# EAGLE design primus (EAGLE 6.1)
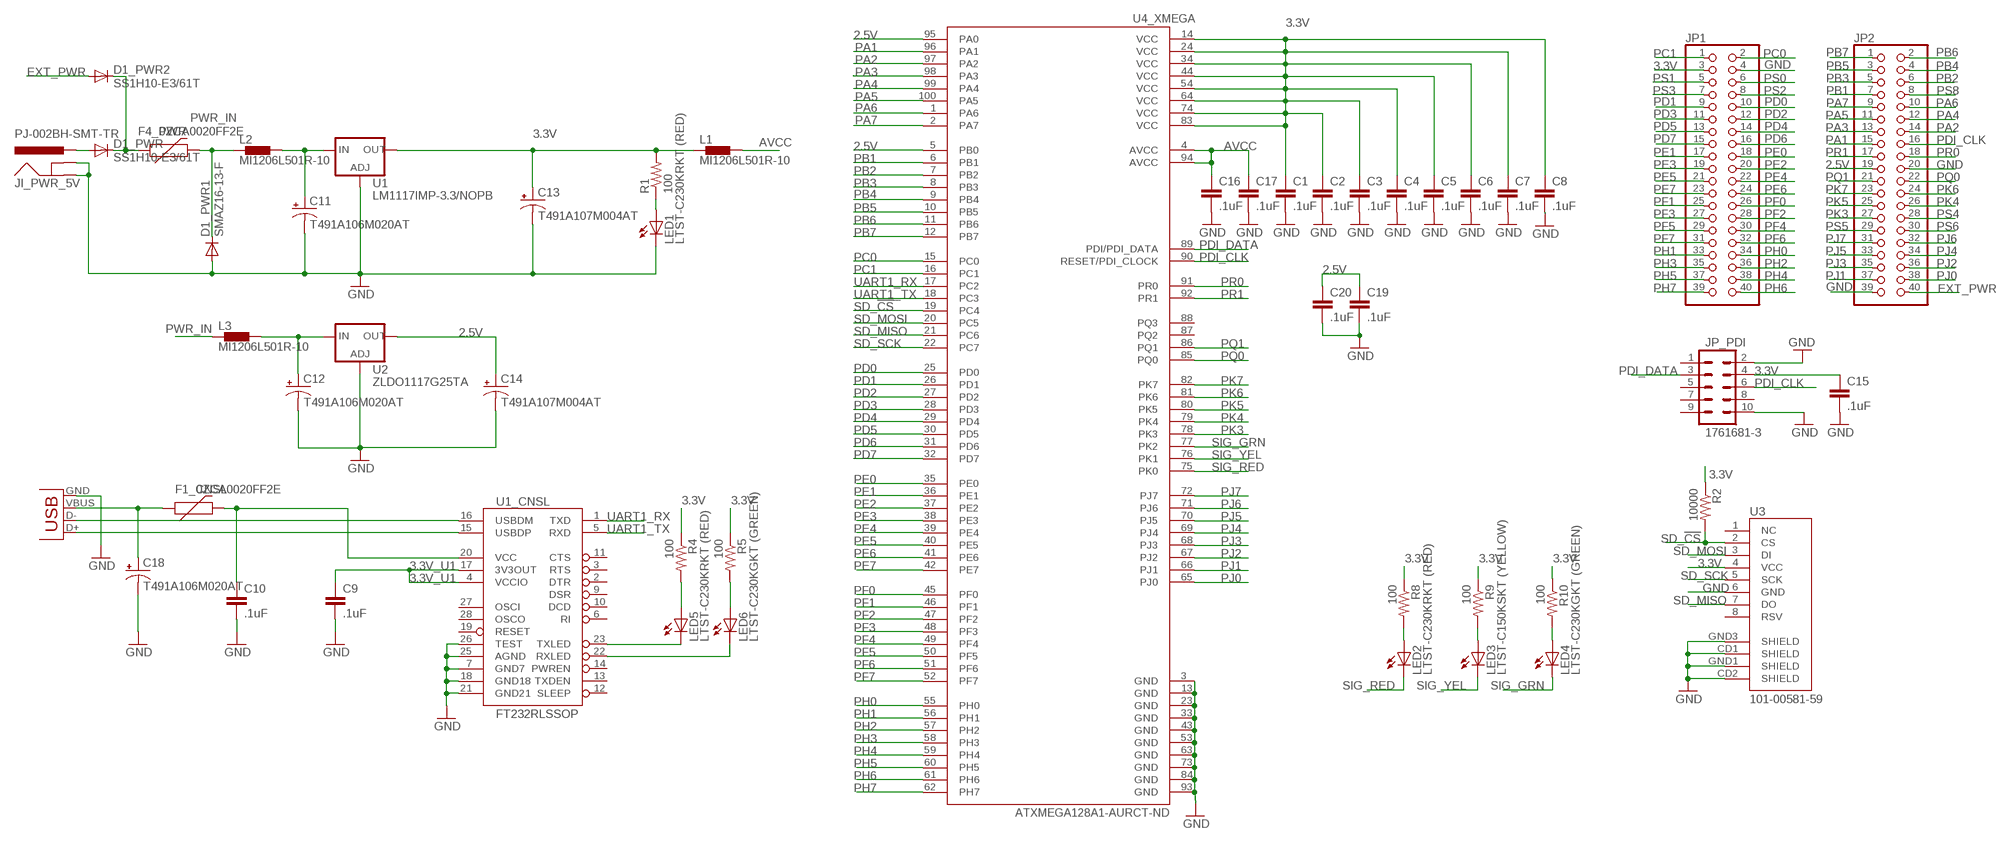
[diagram p0: schematic, sheet 1]

## Parts
C1  .1uF  CAP0603-CAP  [0603-CAP]
C2  .1uF  CAP0603-CAP  [0603-CAP]
C3  .1uF  CAP0603-CAP  [0603-CAP]
C4  .1uF  CAP0603-CAP  [0603-CAP]
C5  .1uF  CAP0603-CAP  [0603-CAP]
C6  .1uF  CAP0603-CAP  [0603-CAP]
C7  .1uF  CAP0603-CAP  [0603-CAP]
C8  .1uF  CAP0603-CAP  [0603-CAP]
C9  .1uF  CAP0603-CAP  [0603-CAP]
C10  .1uF  CAP0603-CAP  [0603-CAP]
C11  T491A106M020AT  CAP_POL1206  [EIA3216]
C12  T491A106M020AT  CAP_POL1206  [EIA3216]
C13  T491A107M004AT  CAP_POL1206  [EIA3216]
C14  T491A107M004AT  CAP_POL1206  [EIA3216]
C15  .1uF  CAP0603-CAP  [0603-CAP]
C16  .1uF  CAP0603-CAP  [0603-CAP]
C17  .1uF  CAP0603-CAP  [0603-CAP]
C18  T491A106M020AT  CAP_POL1206  [EIA3216]
C19  .1uF  CAP0603-CAP  [0603-CAP]
C20  .1uF  CAP0603-CAP  [0603-CAP]
D1_PWR  SS1H10-E3/61T  DIODESMA  [SMA-DIODE]
D1_PWR1  SMAZ16-13-F  DIODESMA  [SMA-DIODE]
D1_PWR2  SS1H10-E3/61T  DIODESMA  [SMA-DIODE]
F1_CNSL  0ZCA0020FF2E  PTCSMD  [PTC-1206]
F4_PWR  0ZCA0020FF2E  PTCSMD  [PTC-1206]
JI_PWR_5V  PJ-002BH-SMT-TR  POWER_JACKSMD  [POWER_JACK_SMD]
JP1  PINHD-2X20  [2X20]
JP2  PINHD-2X20  [2X20]
JP_PDI  1761681-3  M05X2SHD  [2X5-SHROUDED]
L1  MI1206L501R-10  [1206]
L2  MI1206L501R-10  [1206]
L3  MI1206L501R-10  [1206]
LED1  LTST-C230KRKT (RED)  LED1206  [LED-1206]
LED2  LTST-C230KRKT (RED)  LED1206  [LED-1206]
LED3  LTST-C150KSKT (YELLOW)  LED1206  [LED-1206]
LED4  LTST-C230KGKT (GREEN)  LED1206  [LED-1206]
LED5  LTST-C230KRKT (RED)  LED1206  [LED-1206]
LED6  LTST-C230KGKT (GREEN)  LED1206  [LED-1206]
R1  100  RESISTOR0603-RES  [0603-RES]
R2  10000  RESISTOR0603-RES  [0603-RES]
R4  100  RESISTOR0603-RES  [0603-RES]
R5  100  RESISTOR0603-RES  [0603-RES]
R8  100  RESISTOR0603-RES  [0603-RES]
R9  100  RESISTOR0603-RES  [0603-RES]
R10  100  RESISTOR0603-RES  [0603-RES]
U1  LM1117IMP-3.3/NOPB  V_REG_317SMD  [SOT223]
U1_CNSL  FT232RLSSOP  [SSOP28DB]
U2  ZLDO1117G25TA  V_REG_317SMD  [SOT223]
U3  101-00581-59  USD-SOCKETNEW  [MICRO-SD-SOCKET-PP]
U4_XMEGA  ATXMEGA128A1-AURCT-ND  XMEGA-100SMD  [TQFP-100-14X14MM]
X2_CNSL  UX60A-MB-5ST  USBSMD  [USB-MINIB]

## Nets
2.5V: C14.A(+) C19.1 C20.1 JP2.19 U2.2(OUT) U4_XMEGA.5(PB0) U4_XMEGA.95(PA0)
3.3V [power]: C1.1 C2.1 C3.1 C4.1 C5.1 C6.1 C7.1 C8.1 C13.A(+) C15.1 JP1.3 JP_PDI.4 L1.1 R1.2 R2.1 R4.1 R5.1 R8.1 R9.1 R10.1 U1.2(OUT) U3.4(VCC) U4_XMEGA.14(VCC) U4_XMEGA.24(VCC) U4_XMEGA.34(VCC) U4_XMEGA.44(VCC) U4_XMEGA.54(VCC) U4_XMEGA.64(VCC) U4_XMEGA.74(VCC) U4_XMEGA.83(VCC)
3.3V_U1 [power]: C9.1 U1_CNSL.4(VCCIO) U1_CNSL.17(3V3OUT)
AVCC: C16.1 C17.1 L1.2 U4_XMEGA.4(AVCC) U4_XMEGA.94(AVCC)
EXT_PWR: D1_PWR2.A JP2.40
GND [power]: C1.2 C2.2 C3.2 C4.2 C5.2 C6.2 C7.2 C8.2 C9.2 C10.2 C11.C(-) C12.C(-) C13.C(-) C14.C(-) C15.2 C16.2 C17.2 C18.C(-) C19.2 C20.2 D1_PWR1.A JI_PWR_5V.GND(GNDBREAK) JI_PWR_5V.P$4(GND) JP1.4 JP2.20 JP2.39 JP_PDI.2 JP_PDI.10 LED1.C U1.1(ADJ) U1_CNSL.7(GND7) U1_CNSL.18(GND18) U1_CNSL.21(GND21) U1_CNSL.25(AGND) U1_CNSL.26(TEST) U2.1(ADJ) U3.6(GND) U3.CD1(SHIELD) U3.CD2(SHIELD) U3.GND1(SHIELD) U3.GND3(SHIELD) U4_XMEGA.3(GND) U4_XMEGA.13(GND) U4_XMEGA.23(GND) U4_XMEGA.33(GND) U4_XMEGA.43(GND) U4_XMEGA.53(GND) U4_XMEGA.63(GND) U4_XMEGA.73(GND) U4_XMEGA.84(GND) U4_XMEGA.93(GND) X2_CNSL.GND
N$1: LED5.A R4.2
N$2: LED6.A R5.2
N$4: LED2.A R8.2
N$5: LED3.A R9.2
N$6: LED4.A R10.2
N$7: C11.A(+) L2.2 U1.3(IN)
N$8: C12.A(+) L3.2 U2.3(IN)
N$15: D1_PWR.A JI_PWR_5V.VIN0(PWR)
N$16: D1_PWR2.C D1_PWR.C F4_PWR.1
N$19: LED1.A R1.1
N$20 [power]: C10.1 F1_CNSL.2 U1_CNSL.20(VCC)
PA1: JP2.15 U4_XMEGA.96(PA1)
PA2: JP2.14 U4_XMEGA.97(PA2)
PA3: JP2.13 U4_XMEGA.98(PA3)
PA4: JP2.12 U4_XMEGA.99(PA4)
PA5: JP2.11 U4_XMEGA.100(PA5)
PA6: JP2.10 U4_XMEGA.1(PA6)
PA7: JP2.9 U4_XMEGA.2(PA7)
PB1: JP2.7 U4_XMEGA.6(PB1)
PB2: JP2.6 U4_XMEGA.7(PB2)
PB3: JP2.5 U4_XMEGA.8(PB3)
PB4: JP2.4 U4_XMEGA.9(PB4)
PB5: JP2.3 U4_XMEGA.10(PB5)
PB6: JP2.2 U4_XMEGA.11(PB6)
PB7: JP2.1 U4_XMEGA.12(PB7)
PC0: JP1.2 U4_XMEGA.15(PC0)
PC1: JP1.1 U4_XMEGA.16(PC1)
PD0: JP1.10 U4_XMEGA.25(PD0)
PD1: JP1.9 U4_XMEGA.26(PD1)
PD2: JP1.12 U4_XMEGA.27(PD2)
PD3: JP1.11 U4_XMEGA.28(PD3)
PD4: JP1.14 U4_XMEGA.29(PD4)
PD5: JP1.13 U4_XMEGA.30(PD5)
PD6: JP1.16 U4_XMEGA.31(PD6)
PD7: JP1.15 U4_XMEGA.32(PD7)
PDI_CLK: JP2.16 JP_PDI.6 U4_XMEGA.90(RESET/PDI_CLOCK)
PDI_DATA: JP_PDI.3 U4_XMEGA.89(PDI/PDI_DATA)
PE0: JP1.18 U4_XMEGA.35(PE0)
PE1: JP1.17 U4_XMEGA.36(PE1)
PE2: JP1.20 U4_XMEGA.37(PE2)
PE3: JP1.19 U4_XMEGA.38(PE3)
PE4: JP1.22 U4_XMEGA.39(PE4)
PE5: JP1.21 U4_XMEGA.40(PE5)
PE6: JP1.24 U4_XMEGA.41(PE6)
PE7: JP1.23 U4_XMEGA.42(PE7)
PF0: JP1.26 U4_XMEGA.45(PF0)
PF1: JP1.25 U4_XMEGA.46(PF1)
PF2: JP1.28 U4_XMEGA.47(PF2)
PF3: JP1.27 U4_XMEGA.48(PF3)
PF4: JP1.30 U4_XMEGA.49(PF4)
PF5: JP1.29 U4_XMEGA.50(PF5)
PF6: JP1.32 U4_XMEGA.51(PF6)
PF7: JP1.31 U4_XMEGA.52(PF7)
PH0: JP1.34 U4_XMEGA.55(PH0)
PH1: JP1.33 U4_XMEGA.56(PH1)
PH2: JP1.36 U4_XMEGA.57(PH2)
PH3: JP1.35 U4_XMEGA.58(PH3)
PH4: JP1.38 U4_XMEGA.59(PH4)
PH5: JP1.37 U4_XMEGA.60(PH5)
PH6: JP1.40 U4_XMEGA.61(PH6)
PH7: JP1.39 U4_XMEGA.62(PH7)
PJ0: JP2.38 U4_XMEGA.65(PJ0)
PJ1: JP2.37 U4_XMEGA.66(PJ1)
PJ2: JP2.36 U4_XMEGA.67(PJ2)
PJ3: JP2.35 U4_XMEGA.68(PJ3)
PJ4: JP2.34 U4_XMEGA.69(PJ4)
PJ5: JP2.33 U4_XMEGA.70(PJ5)
PJ6: JP2.32 U4_XMEGA.71(PJ6)
PJ7: JP2.31 U4_XMEGA.72(PJ7)
PK3: JP2.27 U4_XMEGA.78(PK3)
PK4: JP2.26 U4_XMEGA.79(PK4)
PK5: JP2.25 U4_XMEGA.80(PK5)
PK6: JP2.24 U4_XMEGA.81(PK6)
PK7: JP2.23 U4_XMEGA.82(PK7)
PQ0: JP2.22 U4_XMEGA.85(PQ0)
PQ1: JP2.21 U4_XMEGA.86(PQ1)
PR0: JP2.18 U4_XMEGA.91(PR0)
PR1: JP2.17 U4_XMEGA.92(PR1)
PS0: JP1.6
PS1: JP1.5
PS2: JP1.8
PS3: JP1.7
PS4: JP2.28
PS5: JP2.29
PS6: JP2.30
PS8: JP2.8
PWR_IN: D1_PWR1.C F4_PWR.2 L2.1 L3.1
RXLED_U1: LED6.C U1_CNSL.22(RXLED)
SD_!CS: R2.2 U3.2(CS) U4_XMEGA.19(PC4)
SD_MISO: U3.7(DO) U4_XMEGA.21(PC6)
SD_MOSI: U3.3(DI) U4_XMEGA.20(PC5)
SD_SCK: U3.5(SCK) U4_XMEGA.22(PC7)
SIG_GRN: LED4.C U4_XMEGA.77(PK2)
SIG_RED: LED2.C U4_XMEGA.75(PK0)
SIG_YEL: LED3.C U4_XMEGA.76(PK1)
TXLED_U1: LED5.C U1_CNSL.23(TXLED)
UART1_RX: U1_CNSL.1(TXD) U4_XMEGA.17(PC2)
UART1_TX: U1_CNSL.5(RXD) U4_XMEGA.18(PC3)
USB_D+: U1_CNSL.15(USBDP) X2_CNSL.D+
USB_D-: U1_CNSL.16(USBDM) X2_CNSL.D-
VBUS: C18.A(+) F1_CNSL.1 X2_CNSL.VBUS
Unconnected: JP_PDI.1 JP_PDI.5 JP_PDI.7 JP_PDI.8 JP_PDI.9 U1_CNSL.2(DTR) U1_CNSL.3(RTS) U1_CNSL.6(RI) U1_CNSL.9(DSR) U1_CNSL.10(DCD) U1_CNSL.11(CTS) U1_CNSL.12(SLEEP) U1_CNSL.13(TXDEN) U1_CNSL.14(PWREN) U1_CNSL.19(RESET) U1_CNSL.27(OSCI) U1_CNSL.28(OSCO) U3.1(NC) U3.8(RSV) U4_XMEGA.87(PQ2) U4_XMEGA.88(PQ3)

## Library data of the parts
C1-C10 C15-C17 C19 C20 = SparkFun-Passives:CAP: Capacitor Standard 0603 ceramic capacitor, and 0.1" leaded capacitor.
C11-C14 C18 = SparkFun-Passives:CAP_POL: Capacitor Polarized These are standard SMD and PTH capacitors. Normally 10uF, 47uF, and 100uF in electrolytic and tantalum varieties. Always verify the external diameter of the through hole cap, it varies with capacity, voltage, and manufacturer. The EIA devices should be standard.
D1_PWR D1_PWR1 D1_PWR2 = SparkFun-DiscreteSemi:DIODE: Diode These are standard reverse protection diodes and small signal diodes. SMA package can handle up to about 1A. SOD-323 can handle about 200mA. What the SOD-323 package when ordering, there are some mfgs out there that are 5-pin packages.
F1_CNSL F4_PWR = SparkFun:PTC: Resettable Fuse PTC Resettable Fuse. Spark Fun Electronics SKU : COM-08357
JI_PWR_5V = SparkFun-Connectors:POWER_JACK: Power Jack This is the standard 5.5mm barrel jack for power. The PTH is the most common, proven, reliable, footprint. All others are experimental. The Slot footprint only works if the mill layer is transmitted to the PCB fab house so be warned. Spark Fun Electronics SKU : PRT-00119. Mating wall wart : TOL-00298 (and others)
JP1 JP2 = pinhead:PINHD-2X20: PIN HEADER
JP_PDI = SparkFun-Connectors:M05X2: Header 5x2 Standard 10-pin dual row 0.1" header. Commonly used with AVR-ISP. Use with Spark Fun Electronics SKU: PRT-00778
L1-L3 = myLib:MI1206L501R-10: FERRITE CHIP POWER 500 OHM SMD
LED1-LED6 = SparkFun-LED:LED: LEDs Standard schematic elements and footprints for 5mm, 3mm, 1206, and 0603 sized LEDs. 5mm - Spark Fun Electronics SKU : COM-00529 (and others)
R1 R2 R4 R5 R8-R10 = SparkFun-Passives:RESISTOR: Resistor Basic schematic elements and footprints for 0603, 1206, and PTH resistors.
U1 U2 = SparkFun-PowerIC:V_REG_317: Voltage Regulator Standard LM317 adjustable voltage regulator. AOI (Adjust Output Input). Google 'LM317 Calculator' for easy to use app to get the two resistor values needed. 240/720 for 5V output. 240/390 for 3.3V output. Spark Fun Electronics SKU : COM-00527
U1_CNSL = SparkFun:FT232RL: USB UART FT232RL 4th Generation USB UART (USB <-> Serial) Controller. Spark Fun Electronics SKU : COM-00650
U3 = SparkFun-Connectors:USD-SOCKET: microSD Socket Push-push type uSD socket. Schematic element and footprint production proven. Spark Fun Electronics SKU : PRT-00127. tDoc lines correctly indicate media card edge positions when inserting (unlocked, locked, depressed).
U4_XMEGA = SparkFun-DigitalIC:XMEGA-100: Atmel XMega uC
X2_CNSL = SparkFun:USB: USB Connectors USB-B-PTH is fully proven SKU : PRT-00139 USB-miniB is fully proven SKU : PRT-00587 USB-A-PCB is untested. USB-A-H is throughly reviewed, but untested. Spark Fun Electronics SKU : PRT-00437 USB-B-SMT is throughly reviewed, but untested. Needs silkscreen touching up. USB-A-S has not been used/tested USB-MB-H has not been used/tested

## Net classes
0 default: width 0.203 mm
1 power: width 0.254 mm

## Board
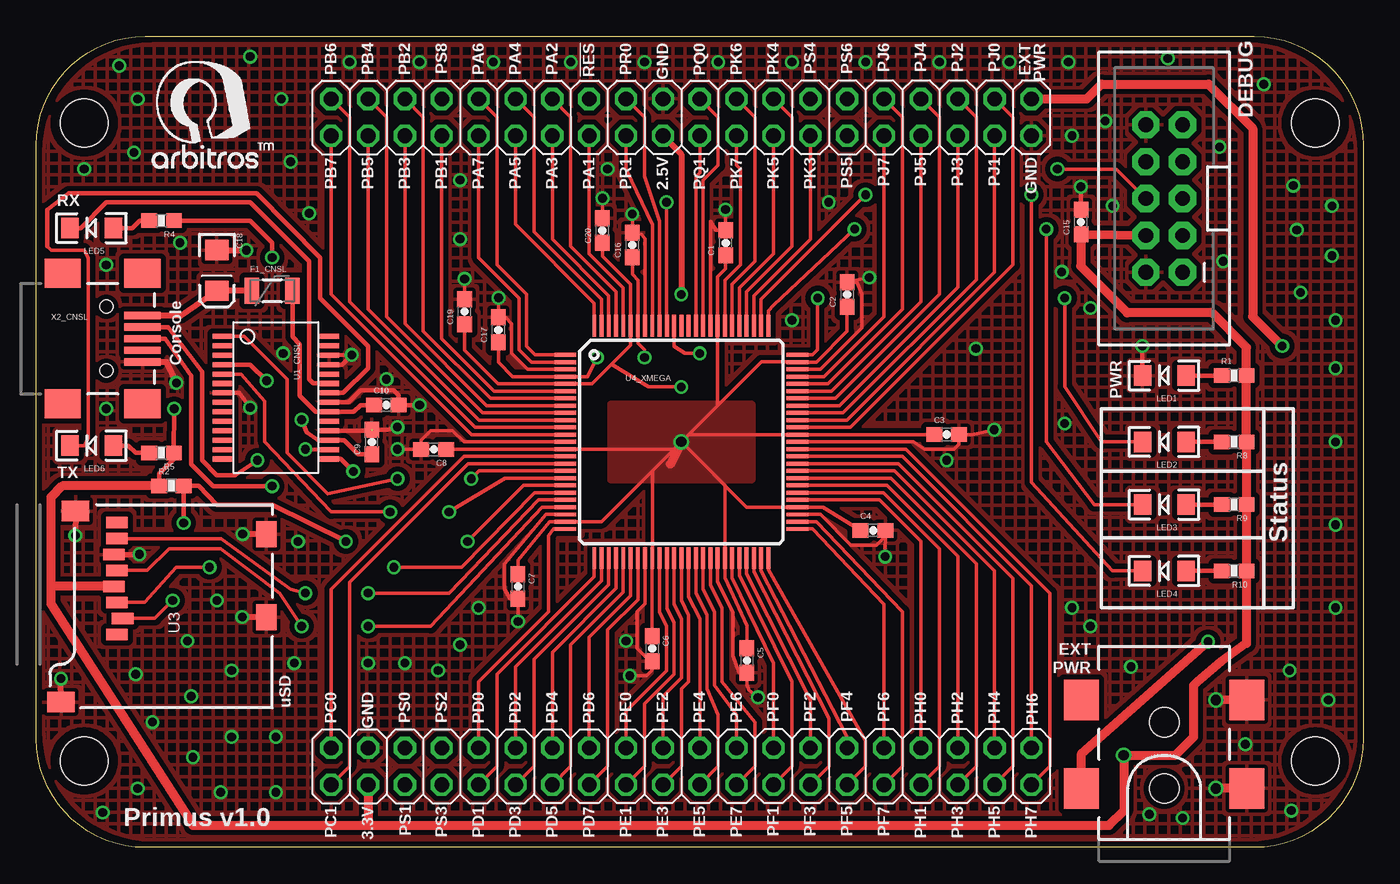
[diagram p1: board, top side]
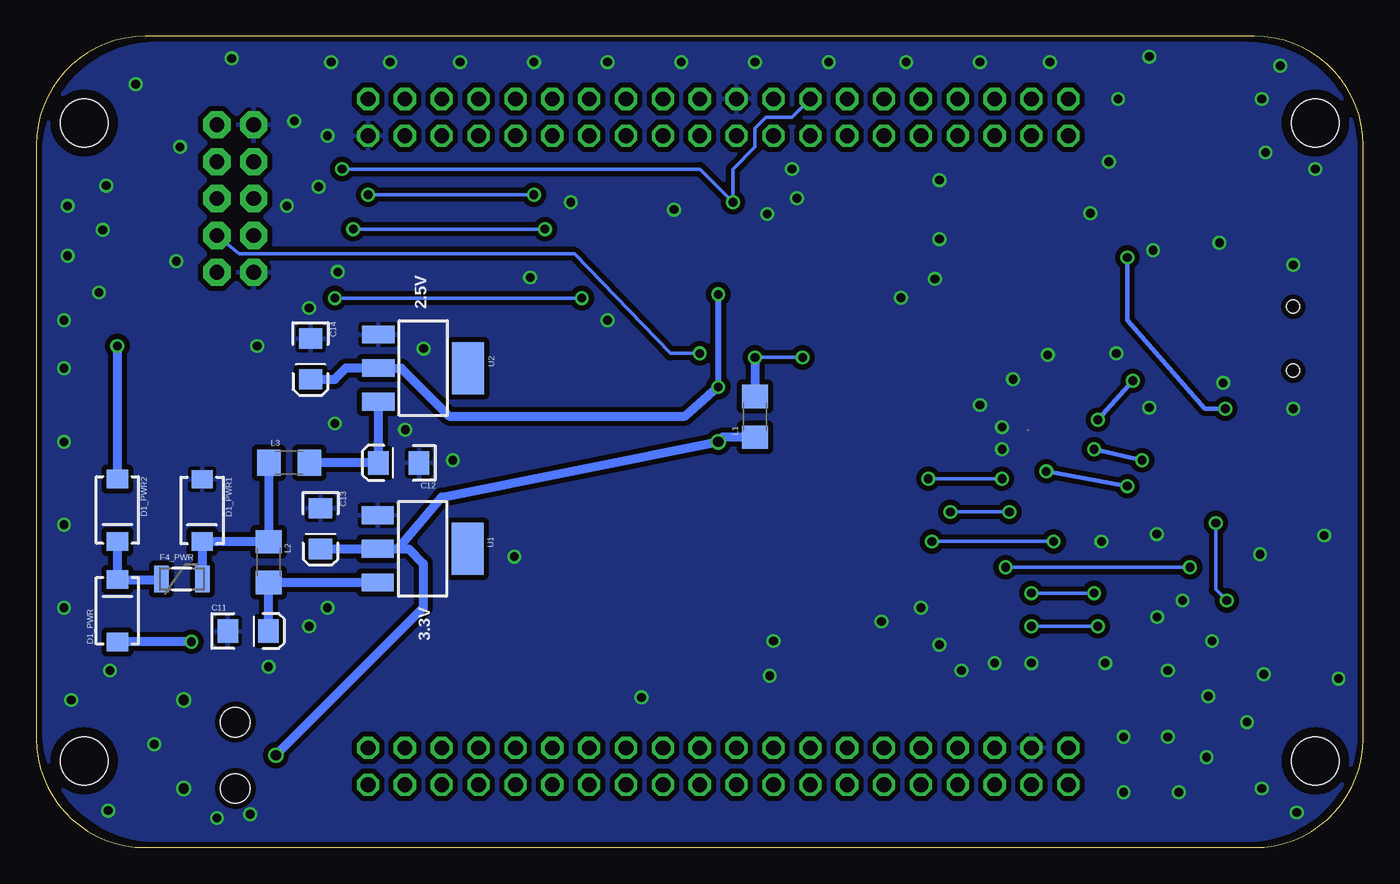
[diagram p2: board, bottom side, seen from below]

Size 91.44 x 55.88 mm. Coordinates in mm from the lower left corner, seen from the top.
Outline: 7.5,55.88 83.94,55.88 arc-90 91.44,48.38 91.44,7.5 arc-90 83.94,0 7.5,0 arc-90 0,7.5 0,48.38 arc-90 7.5,55.88
Copper layers (1*16): Top 0.0356mm / dielectric 1.5011mm / Bottom 0.0356mm
Design rules: minimum track width 6mil, minimum drill 13mil, track to track 6mil, track to pad 6mil, pad to pad 6mil, via to via 6mil, smd to smd 6mil, copper to edge 15mil, drill to drill 6mil, minimum pad ring 7mil, minimum via ring 7mil, stop-mask expansion 4mil, vias tented up to drill 0mil, thermal gap 10mil

### Footprints (pad centres in the part's own frame; a part is rotated, then mirrored left to right if it is on the bottom)
0603-CAP = smd 1.1 x 1: 1 -0.85,0; 2 0.85,0
EIA3216 = smd 1.4 x 1.6: A 1.4,0; C -1.4,0
SMA-DIODE = smd 1.27 x 1.47: A -2.15,0; C 2.15,0
PTC-1206 = smd 1 x 1.8: 1 -1.4,0; 2 1.4,0
POWER_JACK_SMD = smd 2.8 x 2.4: GND 0,-5.7; P$4 6.1,-5.7; VIN0 0,5.7; VIN1 6.1,5.7 | hole 2.032: 0,0; 4.572,0
2X20 = drill 1.016 octagon: 1 -24.13,-1.27; 2 -24.13,1.27; 3 -21.59,-1.27; 4 -21.59,1.27; 5 -19.05,-1.27; 6 -19.05,1.27; 7 -16.51,-1.27; 8 -16.51,1.27; 9 -13.97,-1.27; 10 -13.97,1.27; 11 -11.43,-1.27; 12 -11.43,1.27; 13 -8.89,-1.27; 14 -8.89,1.27; 15 -6.35,-1.27; 16 -6.35,1.27; 17 -3.81,-1.27; 18 -3.81,1.27; 19 -1.27,-1.27; 20 -1.27,1.27; 21 1.27,-1.27; 22 1.27,1.27; 23 3.81,-1.27; 24 3.81,1.27; 25 6.35,-1.27; 26 6.35,1.27; 27 8.89,-1.27; 28 8.89,1.27; 29 11.43,-1.27; 30 11.43,1.27; 31 13.97,-1.27; 32 13.97,1.27; 33 16.51,-1.27; 34 16.51,1.27; 35 19.05,-1.27; 36 19.05,1.27; 37 21.59,-1.27; 38 21.59,1.27; 39 24.13,-1.27; 40 24.13,1.27
2X5-SHROUDED = drill 1.016 pad 1.88 octagon: 1 -1.27,5.08; 2 1.27,5.08; 3 -1.27,2.54; 4 1.27,2.54; 5 -1.27,0; 6 1.27,0; 7 -1.27,-2.54; 8 1.27,-2.54; 9 -1.27,-5.08; 10 1.27,-5.08
1206 = smd 1.6 x 1.8: 1 -1.4,0; 2 1.4,0
LED-1206 = smd 1.2 x 1.4: A -1.5,0; C 1.5,0
0603-RES = smd 1.1 x 1: 1 -0.85,0; 2 0.85,0
SOT223 = smd 1.219 x 2.235: 1 -2.311,-3.099; 2 0,-3.099; 3 2.311,-3.099 | smd 3.6 x 2.2: 4 0,3.099
SSOP28DB = smd 0.348 x 1.397: 1 -4.225,-3.656; 2 -3.575,-3.656; 3 -2.925,-3.656; 4 -2.275,-3.656; 5 -1.625,-3.656; 6 -0.975,-3.656; 7 -0.325,-3.656; 8 0.325,-3.656; 9 0.975,-3.656; 10 1.625,-3.656; 11 2.275,-3.656; 12 2.925,-3.656; 13 3.575,-3.656; 14 4.225,-3.656; 15 4.225,3.656; 16 3.575,3.656; 17 2.925,3.656; 18 2.275,3.656; 19 1.625,3.656; 20 0.975,3.656; 21 0.325,3.656; 22 -0.325,3.656; 23 -0.975,3.656; 24 -1.625,3.656; 25 -2.275,3.656; 26 -2.925,3.656; 27 -3.575,3.656; 28 -4.225,3.656
MICRO-SD-SOCKET-PP = smd 0.8 x 1.5: 1 -8.94,10.7; 2 -7.84,10.3; 3 -6.74,10.7; 4 -5.64,10.9; 5 -4.54,10.7; 6 -3.44,10.9; 7 -2.34,10.7; 8 -1.24,10.7 | smd 1.8 x 1.4: CD1 -2.05,0.4; CD2 -7.75,0.4 | smd 1.4 x 1.9: GND1 -13.6,14.55; GND3 -0.45,13.55
TQFP-100-14X14MM = smd 1.5 x 0.27: 1 -8,6; 2 -8,5.5; 3 -8,5; 4 -8,4.5; 5 -8,4; 6 -8,3.5; 7 -8,3; 8 -8,2.5; 9 -8,2; 10 -8,1.5; 11 -8,1; 12 -8,0.5; 13 -8,0; 14 -8,-0.5; 15 -8,-1; 16 -8,-1.5; 17 -8,-2; 18 -8,-2.5; 19 -8,-3; 20 -8,-3.5; 21 -8,-4; 22 -8,-4.5; 23 -8,-5; 24 -8,-5.5; 25 -8,-6; 51 8,-6; 52 8,-5.5; 53 8,-5; 54 8,-4.5; 55 8,-4; 56 8,-3.5; 57 8,-3; 58 8,-2.5; 59 8,-2; 60 8,-1.5; 61 8,-1; 62 8,-0.5; 63 8,0; 64 8,0.5; 65 8,1; 66 8,1.5; 67 8,2; 68 8,2.5; 69 8,3; 70 8,3.5; 71 8,4; 72 8,4.5; 73 8,5; 74 8,5.5; 75 8,6 | smd 0.27 x 1.5: 26 -6,-8; 27 -5.5,-8; 28 -5,-8; 29 -4.5,-8; 30 -4,-8; 31 -3.5,-8; 32 -3,-8; 33 -2.5,-8; 34 -2,-8; 35 -1.5,-8; 36 -1,-8; 37 -0.5,-8; 38 0,-8; 39 0.5,-8; 40 1,-8; 41 1.5,-8; 42 2,-8; 43 2.5,-8; 44 3,-8; 45 3.5,-8; 46 4,-8; 47 4.5,-8; 48 5,-8; 49 5.5,-8; 50 6,-8; 76 6,8; 77 5.5,8; 78 5,8; 79 4.5,8; 80 4,8; 81 3.5,8; 82 3,8; 83 2.5,8; 84 2,8; 85 1.5,8; 86 1,8; 87 0.5,8; 88 0,8; 89 -0.5,8; 90 -1,8; 91 -1.5,8; 92 -2,8; 93 -2.5,8; 94 -3,8; 95 -3.5,8; 96 -4,8; 97 -4.5,8; 98 -5,8; 99 -5.5,8; 100 -6,8
STAND-OFF = hole 3.302: 0,0
USB-MINIB = smd 2.5 x 0.5: D+ 2.5,0; D- 2.5,0.8; GND 2.5,-1.6; ID 2.5,-0.8; VBUS 2.5,1.6 | smd 2.5 x 2: GND@1 -3,-4.5; GND@2 -3,4.5; GND@3 2.5,4.5; GND@4 2.5,-4.5 | hole 0.9: 0,2.2; 0,-2.2

### Placement (x,y rotation side)
C1  47.5,41.66 90 top
C2  55.88,38.1 90 top
C3  62.74,28.45 0 top
C4  57.66,21.84 0 top
C5  48.97,12.88 270 top
C6  42.44,13.69 270 top
C7  33.2,17.98 270 top
C8  27.38,27.43 180 top
C9  23.11,27.94 90 top
C10  24.13,30.48 0 top
C11  76.83,14.91 0 bottom
C12  66.47,26.49 180 bottom
C13  71.86,21.97 270 bottom
C14  72.54,33.66 270 bottom
C15  71.98,43.08 90 top
C16  41.07,41.5 90 top
C17  31.85,35.66 90 top
C18  12.45,39.75 270 top
C19  29.51,36.91 90 top
C20  39.01,42.49 90 top
D1_PWR  85.85,16.31 90 bottom
D1_PWR1  80.01,23.22 270 bottom
D1_PWR2  85.85,23.24 270 bottom
F1_CNSL  16.26,38.35 0 top
F4_PWR  81.41,18.49 0 bottom
JI_PWR_5V  77.72,4.06 90 top
JP1  44.45,5.59 0 top
JP2  44.45,50.29 0 top
JP_PDI  77.72,44.7 180 top
L1  41.91,29.67 90 bottom
L2  75.44,19.66 270 bottom
L3  74.02,26.49 0 bottom
LED1  77.72,32.51 180 top
LED2  77.72,27.94 180 top
LED3  77.72,23.62 180 top
LED4  77.72,19.05 180 top
LED5  3.81,42.67 180 top
LED6  3.81,27.69 180 top
R1  82.55,32.51 0 top
R2  9.32,24.92 0 top
R4  8.64,43.18 180 top
R5  8.64,27.18 180 top
R8  82.55,27.94 180 top
R9  82.55,23.62 180 top
R10  82.55,19.05 180 top
U1  64.82,20.57 270 bottom
U1_CNSL  16.51,30.99 270 top
U2  64.77,33.02 270 bottom
U3  16.26,23.62 90 top
U4_XMEGA  44.45,27.94 0 top
U$1  [ARBLOGO]  3.3,45.97 0 top
U$2  [STAND-OFF]  88.14,49.91 0 top
U$3  [STAND-OFF]  3.3,49.91 0 top
U$4  [STAND-OFF]  3.3,5.97 0 top
U$5  [STAND-OFF]  88.14,5.97 0 top
X2_CNSL  4.83,35.05 0 top

### Tracks (layer width: path | path; a pad name or v marks a point on that pad's centre or on a via)
2.5V  (via drill 0.6)
  Top 0.254: 39.62,33.27 38.29,31.94 U4_XMEGA.5 31.81,31.94 29.52,34.24 C19.1 | 39.62,33.27 40.95,34.6 U4_XMEGA.95 40.95,38.81 39.01,40.74 C20.1 | v44.45,31.73 42.19,31.73 39.62,33.27
  Top 0.406: JP2.19 44.45,47.75 v44.45,38.1
  Bottom 0.406: v44.45,38.1 v44.45,31.73
  Bottom 0.61: v44.45,31.73 46.74,29.72 62.99,29.72 66.29,33.02 U2.2 arc45 U2.2 70.11,33.02 70.87,32.26 C14.A
3.3V  (via drill 0.6, 0.7)
  Top 0.254: U4_XMEGA.64 53.77,28.45 | v44.45,27.94 42.45,25.94 U4_XMEGA.34 C6.1 | v44.45,27.94 43.95,27.44 U4_XMEGA.14 C8.1 | v44.45,27.94 47.45,24.94 U4_XMEGA.44 47.45,18.59 48.97,15.29 C5.1 | v44.45,27.94 48.95,23.44 U4_XMEGA.54 54.2,23.44 C4.1 | 53.77,28.45 44.96,28.45 v44.45,27.94 | v44.45,27.94 46.95,30.44 U4_XMEGA.83 46.94,35.95 46.94,39.32 47.5,39.88 C1.1 | v44.45,27.94 49.96,33.45 52.44,33.45 U4_XMEGA.74 53.76,33.44 55.88,35.56 C2.1 | 53.77,28.45 C3.1 | v44.45,27.94 38.95,22.44 U4_XMEGA.24 35.37,22.44 33.2,19.79 C7.1
  Top 0.305: R2.1 8.47,25.74 9.49,26.76 R5.1 v9.5,30.23 | R4.1 14.73,43.18 16.26,41.66 v16.26,40.64
  Top 0.61: v44.45,27.94 43.69,26.42 | 22.86,1.52 10.79,1.52 1.02,16.76 1.02,18.03 | 22.86,1.52 73.91,1.52 74.93,2.54 v74.93,6.35 78.49,6.35 79.76,7.62 79.76,11.18 80.01,11.43 81.62,12.79 83.4,14.06 R10.1 R9.1 R8.1 R1.2 83.4,34.46 81.03,36.83 75.18,36.83 71.97,40.04 C15.1 JP_PDI.4 | 1.02,18.03 1.02,24.13 1.8,24.92 R2.1 | U3.4 1.07,17.98 1.02,18.03 | JP1.3 22.86,1.52
  Bottom 0.305: v9.5,30.23 10.92,30.23 16.26,36.32 v16.26,40.64
  Bottom 0.61: C13.A U1.2 | U1.2 arc-45 U1.2 66.56,20.57 arc-45 66.36,20.76 63.5,24.13 v44.45,27.94 44.12,28.27 L1.1 | U1.2 65.78,20.57 64.77,19.56 64.77,16.51 v74.93,6.35
  pour Top: 39.62,30.48 39.62,25.4 49.28,25.4 49.28,30.48
3.3V_U1  (via drill 0.6)
  Top 0.305: C9.1 22.19,27.09 21.21,28.06 U1_CNSL.17 19.43,28.06 18.64,28.6 v18.29,29.46 | U1_CNSL.4 14.74,33.26 v15.88,32.16
  Bottom 0.305: v15.88,32.16 v18.29,29.46
AVCC  (via drill 0.6)
  Top 0.254: U4_XMEGA.4 | U4_XMEGA.4 37.97,32.44 v38.63,33.76 | v41.91,33.76 41.91,34.29 41.45,34.75 U4_XMEGA.94 41.45,39.07 41.07,39.5 C16.1 | U4_XMEGA.4 32.84,32.44 31.85,33.43 C17.1
  Bottom 0.254: v38.63,33.76 v41.91,33.76
  Bottom 0.61: v41.91,33.76 L1.2
EXT_PWR  (via drill 0.6)
  Top 0.61: JP2.40 72.39,51.56 73.41,52.58 80.77,52.58 83.82,49.53 83.82,36.58 v85.85,34.54
  Bottom 0.61: v85.85,34.54 D1_PWR2.A
GND  (via drill 0.6, 0.7)  (1 unrouted)
  Top 0.254: v57.4,39.27 C2.2 56.55,38.95 56.9,38.1 56.9,35.81 54.02,32.94 U4_XMEGA.73 | v58.5,20.04 C4.2 58.51,21.42 57.91,20.83 56.13,20.83 54.02,22.94 U4_XMEGA.53 | 41.96,35.95 U4_XMEGA.93 41.95,41.95 41.7,42.25 C16.2 v41.07,43.64 | v47.5,43.94 C1.2 46.82,42.51 46.45,43.15 U4_XMEGA.84 | v33.2,15.57 C7.2 32.65,17.13 32.26,17.78 32.26,19.56 35.13,22.94 U4_XMEGA.23 | v24.89,27.43 C8.2 26.53,28.05 27.18,28.7 28.7,28.7 29.46,27.94 U4_XMEGA.13 | v31.85,37.87 C17.2 32.32,36.51 32.77,36.07 32.77,34.04 33.86,32.94 U4_XMEGA.3 | C19.2 v29.52,39.17 | C20.2 v39.01,44.73 | U4_XMEGA.63 60.45,27.94 61.21,27.43 63.25,27.43 63.59,27.77 C3.2 64.52,28.45 v66.02,28.78 | U4_XMEGA.33 41.95,16.8 41.4,16.26 41.4,13.72 42.28,12.84 C6.2 42.44,12.22 42.06,11.84 v40.89,11.84 | U4_XMEGA.43 46.95,18.33 48.01,16.15 48.01,13.21 48.42,12.03 C5.2 48.97,11.23 49.1,10.85 v49.73,10.34
  Top 0.305: U1_CNSL.26 v21.74,33.93 21.07,33.26 U1_CNSL.25 | C9.2 24.22,28.79 v24.89,28.96 | U1_CNSL.18 23.1,28.71 23.11,28.7 | U1_CNSL.7 13.97,31.31 v14.73,30.3 | C15.2 v71.98,45.52 | LED1.C 76.22,33.76 v76.22,34.54 | U1_CNSL.21 21.52,30.66 22.35,31.5 24.64,31.5 24.98,31.15 C10.2 v26.42,30.48
  Top 0.406: v9.65,32 8.97,33.45 X2_CNSL.GND | U3.GND3 v2.69,21.49 | U3.6 v7.11,20.19 | U3.GND1 v1.7,11.63 | U3.CD2 v14.2,15.88 | U3.CD1 v14.22,21.59 | C18.C v14.48,41.15
  Top 0.61: JI_PWR_5V.P$4 v81.28,10.16 | JI_PWR_5V.GND v81.28,4.06
  other vias: 12.45,17.02 13.46,12.19 6.86,11.94 25.4,12.7 29.21,13.97 30.48,16.51 22.86,12.7 16.51,7.62 6.99,4.06 10.79,6.22 10.67,10.41 16.51,3.81 12.7,3.81 8,8.64 4.57,2.41 13.46,7.62 10.41,14.22 17.78,12.7 29.21,45.97 29.21,41.91 39.37,46.74 54.61,44.45 27.69,12.19 40.64,14.22 52.07,36.32 62.74,26.67 70.87,29.21 71.37,49.02 73.66,50.04 74.17,44.2 71.37,16.51 72.64,15.24 75.44,12.45 76.71,2.29 78.99,2.03 86.36,12.19 89.03,10.16 86.61,45.59 89.28,44.2 86.87,42.55 89.28,40.77 87.12,38.23 89.53,36.32 89.53,33.02 89.53,27.94 83.31,7.11 21.59,54.1 26.42,54.1 31.5,54.1 36.83,54.1 41.91,54.1 46.99,54.1 52.07,54.1 57.15,54.1 62.23,54.1 67.06,54.1 71.12,54.1 77.98,54.36 84.58,52.58 81.79,40.39 81.53,48.26 18.03,21.08 6.73,47.88 70.66,39.65 72.64,37.16 4.83,30.23 4.83,40.13 9.91,41.66 17.02,34.04 24.13,32.26 18.8,43.69 3.3,46.74 5.71,53.85 6.99,51.56 14.73,54.48 17.53,47.24 16.89,51.56 64.74,34.37 89.53,22.23 89.53,16.51 86.49,2.54
  pour Bottom (isolate 0.356): 90.93,47.87 90.93,8.01 arc-90 82.8,0.51 8.01,0.51 arc-90 0.51,8.01 0.51,47.87 arc-90 8.01,55.37 82.8,55.37 arc-90
  pour Top (isolate 0.356, rank 2, hatched): 0.51,8.01 0.51,47.87 arc-90 8.01,55.37 83.43,55.37 arc-90 90.93,47.87 90.93,7.37 arc-90 82.8,0.51 8.01,0.51 arc-90
N$1
  Top 0.305: LED5.A 6.6,42.67 7.11,43.18 R4.2
N$2
  Top 0.305: LED6.A 6.35,27.69 6.86,27.18 R5.2
N$4
  Top 0.305: LED2.A R8.2
N$5
  Top 0.305: LED3.A R9.2
N$6
  Top 0.305: LED4.A R10.2
N$7
  Bottom 0.61: C11.A L2.2 arc-45 L2.2 U1.3 arc-45 U1.3
N$8
  Bottom 0.61: L3.2 C12.A arc-45 67.87,27.01 U2.3
N$15  (via drill 0.6)
  Top 0.61: JI_PWR_5V.VIN0 72.02,6.47 v80.75,14.17
  Bottom 0.61: v80.75,14.17 85.84,14.17 D1_PWR.A
N$16
  Bottom 0.61: D1_PWR2.C D1_PWR.C 82.89,18.46 arc-45 F4_PWR.1
N$19
  Top 0.305: R1.1 LED1.A
N$20
  Top 0.305: C10.1 22.35,30.48 21.89,30.01 U1_CNSL.20 19.26,30.01 18.16,31.11 18.16,34.67 17.66,35.18 F1_CNSL.2
PA1
  Top 0.254: U4_XMEGA.96 40.45,38.54 38.1,40.89 JP2.15
PA2
  Top 0.254: U4_XMEGA.97 39.95,38.28 36.83,41.4 36.83,50.29 JP2.14
PA3
  Top 0.254: U4_XMEGA.98 39.45,38.02 35.56,41.91 JP2.13
PA4
  Top 0.254: U4_XMEGA.99 38.95,37.76 34.29,42.42 34.29,50.29 JP2.12
PA5
  Top 0.254: U4_XMEGA.100 38.45,37.5 33.02,42.93 JP2.11
PA6
  Top 0.254: U4_XMEGA.1 34.39,33.94 33.78,34.54 33.78,38.1 31.75,40.13 31.75,50.29 JP2.10
PA7
  Top 0.254: U4_XMEGA.2 34.12,33.44 33.27,34.29 33.27,37.85 30.48,40.64 JP2.9
PB1
  Top 0.254: U4_XMEGA.6 31.55,31.44 27.94,35.05 JP2.7
PB2
  Top 0.254: U4_XMEGA.7 31.29,30.94 26.67,35.56 26.67,50.29 JP2.6
PB3
  Top 0.254: U4_XMEGA.8 31.03,30.44 25.4,36.07 JP2.5
PB4
  Top 0.254: JP2.4 24.13,50.29 24.13,36.58 30.77,29.94 U4_XMEGA.9
PB5
  Top 0.254: U4_XMEGA.10 30.5,29.44 22.86,37.08 JP2.3
PB6
  Top 0.254: U4_XMEGA.11 30.24,28.94 21.59,37.59 21.59,50.29 JP2.2
PB7
  Top 0.254: U4_XMEGA.12 29.98,28.44 20.32,38.1 JP2.1
PC0
  Top 0.254: U4_XMEGA.15 29.48,26.94 20.32,17.78 JP1.2
PC1
  Top 0.254: JP1.1 21.59,5.59 21.59,18.29 29.74,26.44 U4_XMEGA.16
PD0
  Top 0.254: U4_XMEGA.25 35.66,21.94 35.31,21.46 35.31,16.26 30.48,11.43 JP1.10
PD1
  Top 0.254: U4_XMEGA.26 38.45,18.64 31.75,11.94 31.75,5.59 JP1.9
PD2
  Top 0.254: U4_XMEGA.27 38.95,18.38 33.02,12.45 JP1.12
PD3
  Top 0.254: U4_XMEGA.28 39.45,18.11 34.29,12.95 34.29,5.59 JP1.11
PD4
  Top 0.254: U4_XMEGA.29 39.95,17.85 35.56,13.46 JP1.14
PD5
  Top 0.254: U4_XMEGA.30 40.45,17.59 36.83,13.97 36.83,5.59 JP1.13
PD6
  Top 0.254: U4_XMEGA.31 40.95,17.33 38.1,14.48 JP1.16
PD7
  Top 0.254: U4_XMEGA.32 41.45,17.07 39.37,14.99 39.37,5.59 JP1.15
PDI_CLK  (via drill 0.6)
  Top 0.254: JP_PDI.6 74.42,46.74 v70.36,46.74 | v43.43,44.45 43.43,35.92 U4_XMEGA.90
  Bottom 0.254: v70.36,46.74 45.72,46.74 v43.43,44.45 43.43,46.74 41.91,48.26 41.91,49.53 41.15,50.29 39.37,50.29 JP2.16
PDI_DATA  (via drill 0.6)
  Top 0.254: U4_XMEGA.89 43.95,34.54 44.7,34.04 v45.72,34.04
  Bottom 0.254: v45.72,34.04 47.75,34.04 54.36,40.89 77.47,40.89 JP_PDI.3
PE0
  Top 0.254: U4_XMEGA.35 42.95,16.23 43.43,15.24 43.43,12.19 40.64,9.4 JP1.18
PE1
  Top 0.254: U4_XMEGA.36 43.45,16.49 43.94,15.49 43.94,11.94 41.91,9.91 41.91,5.59 JP1.17
PE2
  Top 0.254: U4_XMEGA.37 43.95,16.76 44.45,15.75 44.45,11.68 43.18,10.41 JP1.20
PE3
  Top 0.254: U4_XMEGA.38 44.45,17.02 44.96,16 44.96,11.43 44.45,10.92 44.45,5.59 JP1.19
PE4
  Top 0.254: U4_XMEGA.39 44.95,17.28 45.72,15.75 JP1.22
PE5
  Top 0.254: U4_XMEGA.40 45.45,17.54 46.23,16 46.23,10.92 46.99,9.14 46.99,5.59 JP1.21
PE6
  Top 0.254: U4_XMEGA.41 45.95,17.8 46.74,16.26 46.74,11.18 48.26,9.14 JP1.24
PE7
  Top 0.254: U4_XMEGA.42 46.45,18.07 47.24,16.51 47.24,11.43 49.53,8.64 49.53,5.59 JP1.23
PF0
  Top 0.254: U4_XMEGA.45 47.95,18.6 50.8,12.7 JP1.26
PF1
  Top 0.254: U4_XMEGA.46 48.45,18.76 52.07,11.43 52.07,5.59 JP1.25
PF2
  Top 0.254: U4_XMEGA.47 48.95,18.87 53.34,10.16 JP1.28
PF3
  Top 0.254: U4_XMEGA.48 49.45,19 54.61,8.89 54.61,5.59 JP1.27
PF4
  Top 0.254: U4_XMEGA.49 49.95,19.06 55.88,7.62 JP1.30
PF5
  Top 0.254: U4_XMEGA.50 50.45,19.15 57.15,7.37 57.15,5.59 JP1.29
PF6
  Top 0.254: U4_XMEGA.51 53.5,21.94 58.42,16.76 JP1.32
PF7
  Top 0.254: U4_XMEGA.52 53.76,22.44 59.69,16.26 59.69,5.59 JP1.31
PH0
  Top 0.254: U4_XMEGA.55 58.1,23.94 60.96,21.08 JP1.34
PH1
  Top 0.254: U4_XMEGA.56 58.36,24.44 62.23,20.57 62.23,5.59 JP1.33
PH2
  Top 0.254: U4_XMEGA.57 58.63,24.94 63.5,20.07 JP1.36
PH3
  Top 0.254: U4_XMEGA.58 58.89,25.44 64.77,19.56 64.77,5.59 JP1.35
PH4
  Top 0.254: U4_XMEGA.59 59.15,25.94 66.04,19.05 JP1.38
PH5
  Top 0.254: U4_XMEGA.60 59.41,26.44 67.31,18.54 67.31,5.59 JP1.37
PH6
  Top 0.254: U4_XMEGA.61 59.67,26.94 68.58,18.03 JP1.40
PH7
  Top 0.254: U4_XMEGA.62 59.94,27.44 69.85,17.53 69.85,5.59 JP1.39
PJ0
  Top 0.254: U4_XMEGA.65 56.12,28.94 67.31,40.13 67.31,50.29 JP2.38
PJ1
  Top 0.254: U4_XMEGA.66 55.86,29.44 66.04,39.62 JP2.37
PJ2
  Top 0.254: U4_XMEGA.67 55.59,29.94 64.77,39.12 64.77,50.29 JP2.36
PJ3
  Top 0.254: U4_XMEGA.68 55.33,30.44 63.5,38.61 JP2.35
PJ4
  Top 0.254: U4_XMEGA.69 55.07,30.94 62.23,38.1 62.23,50.29 JP2.34
PJ5
  Top 0.254: U4_XMEGA.70 54.81,31.44 60.96,37.59 JP2.33
PJ6
  Top 0.254: U4_XMEGA.71 54.55,31.94 59.69,37.08 59.69,50.29 JP2.32
PJ7
  Top 0.254: U4_XMEGA.72 54.28,32.44 58.42,36.58 JP2.31
PK3
  Top 0.254: U4_XMEGA.78 49.45,38.02 53.34,41.91 JP2.27
PK4
  Top 0.254: U4_XMEGA.79 48.95,38.28 52.07,41.4 52.07,50.29 JP2.26
PK5
  Top 0.254: U4_XMEGA.80 48.45,38.54 50.8,40.89 JP2.25
PK6
  Top 0.254: U4_XMEGA.81 47.95,38.81 49.53,40.39 49.53,50.29 JP2.24
PK7
  Top 0.254: U4_XMEGA.82 47.45,39.07 48.51,40.13 48.51,46.74 48.26,46.99 JP2.23
PQ0
  Top 0.254: U4_XMEGA.85 45.95,45.95 46.99,46.99 46.99,50.29 JP2.22
PQ1
  Top 0.254: U4_XMEGA.86 45.45,46.21 45.72,46.48 JP2.21
PR0
  Top 0.254: U4_XMEGA.91 42.95,43.16 41.91,46.23 41.91,50.29 JP2.18
PR1
  Top 0.254: U4_XMEGA.92 42.45,42.89 40.64,46.74 JP2.17
PWR_IN
  Bottom 0.61: F4_PWR.2 arc45 F4_PWR.2 D1_PWR1.C arc-45 80,21.06 L2.1 arc-45 75.42,21.11 L3.1
RXLED_U1
  Top 0.254: 0.76,41.4 1.02,41.15 3.3,41.15 3.58,40.64 3.58,28.19 3.3,27.69 LED6.C
  Top 0.305: U1_CNSL.22 21.15,31.31 22.86,33.02 22.86,34.54 19.56,37.85 19.56,40.64 15.19,45.06 2.23,45.06 0.76,43.94 0.76,41.4
SD_!CS  (via drill 0.6)
  Top 0.254: U4_XMEGA.19 33.58,24.94 v29.72,21.08 | v9.4,17.02 8.16,15.78 U3.2
  Top 0.305: v21.34,21.08 16.26,23.62 12.45,23.62 11.18,24.93 R2.2 10.16,24.65 v10.16,22.35
  Bottom 0.254: v29.72,21.08 v21.34,21.08 | v10.16,22.35 10.16,17.78 v9.4,17.02
SD_MISO  (via drill 0.6)
  Top 0.254: U4_XMEGA.21 34.61,23.94 28.45,17.53 v22.86,17.53 | v18.54,17.53 17.53,17.78 12.75,21.28 U3.7
  Bottom 0.254: v22.86,17.53 v18.54,17.53
SD_MOSI  (via drill 0.6)
  Top 0.254: U4_XMEGA.20 34.35,24.44 29.31,19.3 v24.64,19.3 | v11.94,19.3 9.65,19.3 7.48,16.88 U3.3
  Bottom 0.254: v24.64,19.3 v11.94,19.3
SD_SCK  (via drill 0.6)
  Top 0.254: U4_XMEGA.22 34.87,23.44 27.18,15.24 v22.86,15.24 | v18.29,15.24 16.76,17.53 12.7,20.57 9.14,20.57 7.65,19.08 U3.5
  Bottom 0.254: v22.86,15.24 v18.29,15.24
SIG_GRN  (via drill 0.6)
  Top 0.254: U4_XMEGA.77 49.95,37.76 v57.15,44.96 | v68.58,44.96 68.58,25.15 74.17,19.05 LED4.C
  Bottom 0.254: v57.15,44.96 v68.58,44.96
SIG_RED  (via drill 0.6)
  Top 0.254: U4_XMEGA.75 53.5,33.94 53.85,34.29 v53.85,37.85 | v70.87,37.85 70.87,31.75 73.41,27.94 LED2.C
  Bottom 0.254: v53.85,37.85 v70.87,37.85
SIG_YEL  (via drill 0.6)
  Top 0.254: U4_XMEGA.76 50.45,36.99 50.8,37.34 v56.39,42.6 | v69.6,42.6 69.6,27.94 72.9,23.62 LED3.C
  Bottom 0.254: v56.39,42.6 v69.6,42.6
TXLED_U1
  Top 0.305: U1_CNSL.23 19.09,31.96 18.8,32.26 18.8,40.39 14.73,44.45 4.83,44.45 3.05,42.67 LED5.C
UART1_RX  (via drill 0.6)
  Top 0.254: U4_XMEGA.17 30.51,25.94 v29.97,25.4 | v24.89,25.4 20.07,24.38 17.27,27.18 17.27,32.26 14.32,35.21 U1_CNSL.1
  Bottom 0.254: v29.97,25.4 v24.89,25.4
UART1_TX  (via drill 0.6)
  Top 0.254: U4_XMEGA.18 32.3,25.44 v28.45,23.11 | v24.38,23.11 20.32,23.11 15.75,27.94 15.75,30.73 14.12,32.61 U1_CNSL.5
  Bottom 0.254: v28.45,23.11 v24.38,23.11
USB_D+  (via drill 0.6)
  Top 0.305: X2_CNSL.D+ 8.89,35.05 10.67,32.51 10.67,26.42 12.19,24.89 v16.26,24.89 | v21.84,25.91 20.99,26.76 U1_CNSL.15
  Bottom 0.305: v16.26,24.89 v21.84,25.91
USB_D-  (via drill 0.6)
  Top 0.305: X2_CNSL.D- 9.11,35.85 11.43,32.77 11.43,26.67 12.45,25.65 13.72,25.65 v15.24,26.67 | v18.54,27.43 U1_CNSL.16
  Bottom 0.305: v15.24,26.67 v18.54,27.43
VBUS
  Top 0.406: X2_CNSL.VBUS 9.98,36.65 C18.A F1_CNSL.1

### Text on the board
tPlace: PB6 | PB4 | PB2 | PS8 | PA6 | PA4 | PA2 | !RES | PR0 | GND | PQ0 | PK6 | PK4 | PS4 | PS6 | PJ6 | PJ4 | PJ2 | PJ0 | EXT | PWR | DEBUG | PB7 | PB5 | PB3 | PB1 | PA7 | PA5 | PA3 | PA1 | PR1 | 2.5V | PQ1 | PK7 | PK5 | PK3 | PS5 | PJ7 | PJ5 | PJ3 | PJ1 | GND | RX | Console | PWR | Status | TX | EXT | PWR | PC0 | GND | PS0 | PS2 | PD0 | PD2 | PD4 | PD6 | PE0 | PE2 | PE4 | PE6 | PF0 | PF2 | PF4 | PF6 | PH0 | PH2 | PH4 | PH6 | uSD | PC1 | 3.3V | PS1 | PS3 | PD1 | PD3 | PD5 | PD7 | PE1 | PE3 | PE5 | PE7 | PF1 | PF3 | PF5 | PF7 | PH1 | PH3 | PH5 | PH7 | Primus v1.0
bPlace: 2.5V | 3.3V